# EAGLE design BBBL-CAN-GPS-RC-Interface (EAGLE 9.1.1)
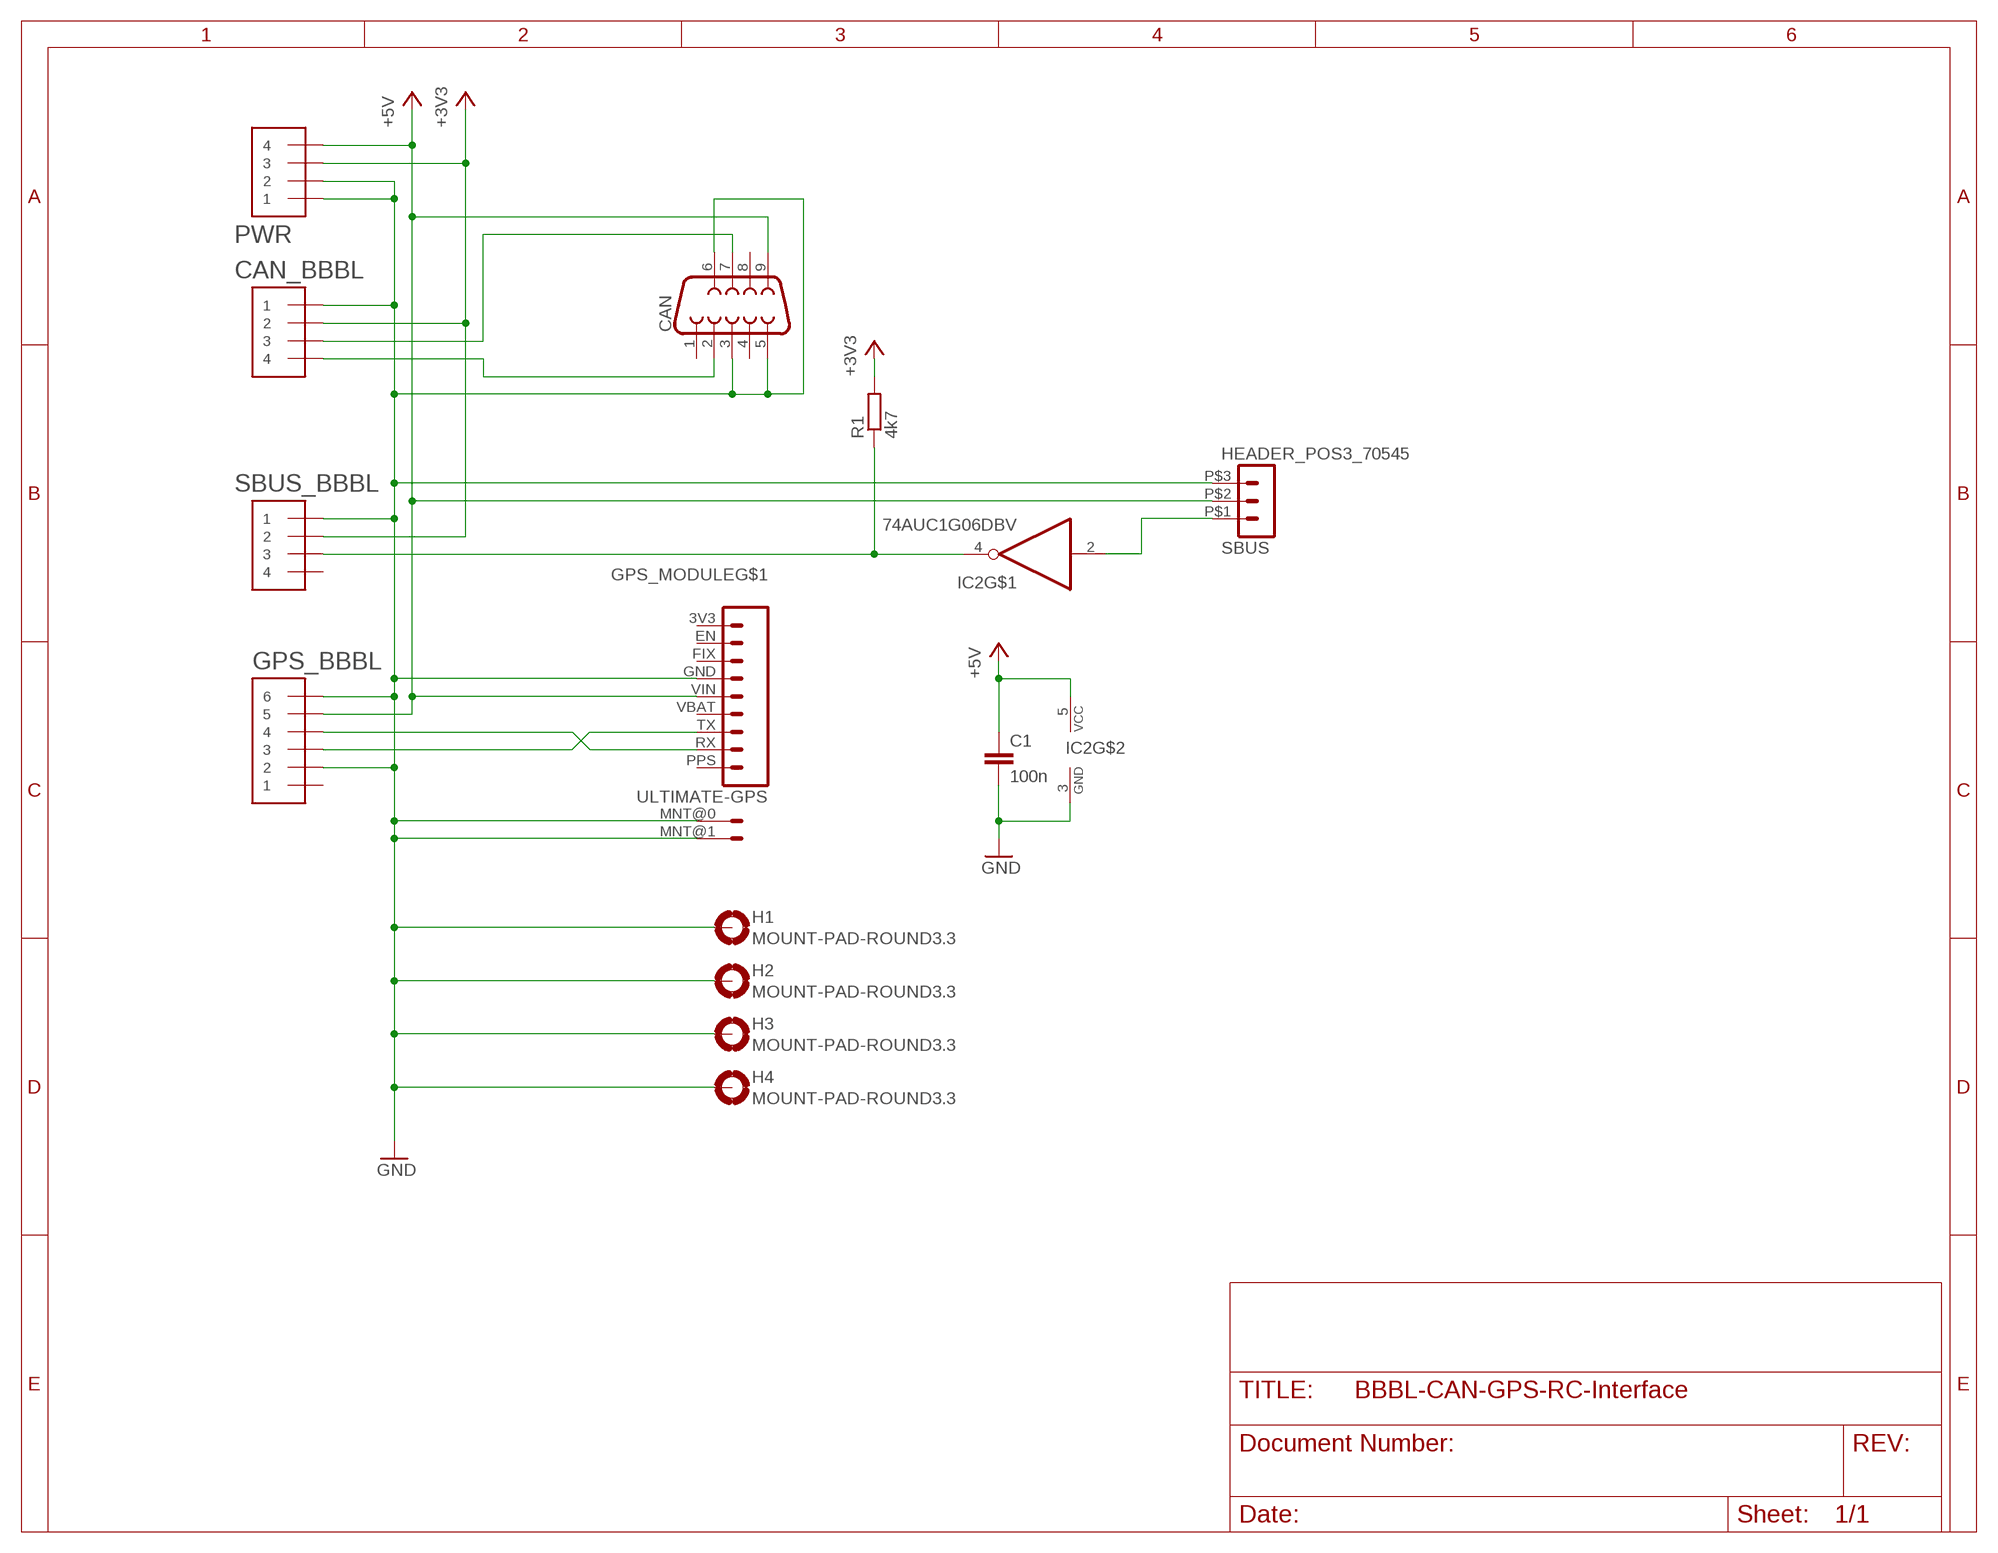
[diagram p0: schematic, sheet 1]

## Parts
C1  100n  C-EUC0603  [C0603]
CAN  DB9MALE  [DB9_MALE]
CAN_BBBL  STRAWSON_EAGLE_LIB_JST_SH_4  [STRAWSON_EAGLE_LIB_JST_SH_4_SMD]
GPS_BBBL  STRAWSON_EAGLE_LIB_JST_SH_6  [STRAWSON_EAGLE_LIB_JST_SH_6]
GPS_MODULE  ULTIMATE-GPS  [ULTIMATE-GPS]
H1  MOUNT-PAD-ROUND3.3  [3,3-PAD]
H2  MOUNT-PAD-ROUND3.3  [3,3-PAD]
H3  MOUNT-PAD-ROUND3.3  [3,3-PAD]
H4  MOUNT-PAD-ROUND3.3  [3,3-PAD]
IC2  74AUC1G06DBV  [SOT23-5]
PWR  STRAWSON_EAGLE_LIB_JST_SH_4  [STRAWSON_EAGLE_LIB_JST_SH_4_SMD]
R1  4k7  R-EU_R0603  [R0603]
SBUS  HEADER_POS3_70545  [70545-POS3]
SBUS_BBBL  STRAWSON_EAGLE_LIB_JST_SH_4  [STRAWSON_EAGLE_LIB_JST_SH_4_SMD]

## Nets
+3V3: CAN_BBBL.2 PWR.3 R1.2 SBUS_BBBL.2
+5V: C1.1 CAN.9 GPS_BBBL.5 GPS_MODULE.VIN IC2.5(VCC) PWR.4 SBUS.P$2
GND: C1.2 CAN.3 CAN.5 CAN.6 CAN_BBBL.1 GPS_BBBL.2 GPS_BBBL.6 GPS_MODULE.GND GPS_MODULE.MNT@0 GPS_MODULE.MNT@1 H1.B3,3(MOUNT) H2.B3,3(MOUNT) H3.B3,3(MOUNT) H4.B3,3(MOUNT) IC2.3(GND) PWR.1 PWR.2 SBUS.P$3 SBUS_BBBL.1
N$1: GPS_BBBL.3 GPS_MODULE.TX
N$2: GPS_BBBL.4 GPS_MODULE.RX
N$3: CAN.7 CAN_BBBL.3
N$4: CAN.2 CAN_BBBL.4
N$5: IC2.4(O) R1.1 SBUS_BBBL.3
N$6: IC2.2(I) SBUS.P$1
Unconnected: CAN.1 CAN.4 CAN.8 GPS_BBBL.1 GPS_MODULE.3V3 GPS_MODULE.EN GPS_MODULE.FIX GPS_MODULE.PPS GPS_MODULE.VBAT SBUS_BBBL.4

## Library data of the parts
C1 = resistor:C-EU: CAPACITOR, European symbol
CAN = SparkFun-Connectors:DB9: DB9 Connector Standard DB9 (D-Sub 9) serial connector. Can be used for CAN bus as well as RS485 and RS232. Footprint production proven. Here is the female version connector we sell at SparkFun: 9 Pin Female Serial Connector - PCB Mount <https://www.sparkfun.com/products/429> (PRT-00429) This connector has been used on the following SparkFun products: SparkFun RS232 Shifter - SMD <https://www.sparkfun.com/products/449> (PRT-00449) SparkFun RS232 Shifter SMD (No DB9) <https://www.sparkfun.com/products/8780> (PRT-08780); PROD_ID: CONN-09904
CAN_BBBL PWR SBUS_BBBL = BeagleBone_Blue:STRAWSON_EAGLE_LIB_JST_SH_4
GPS_BBBL = BeagleBone_Blue:STRAWSON_EAGLE_LIB_JST_SH_6
GPS_MODULE = adafruit-sensor-boards:ULTIMATE-GPS
H1-H4 = holes:MOUNT-PAD-ROUND: MOUNTING PAD, round
IC2 = 74xx-little-us:74*1G06: Single Inverter Buffer/Driver With Open-Drain Output
R1 = resistor:R-EU_: RESISTOR, European symbol
SBUS = con-molex-c-grid-sl:HEADER_POS3_?: Molex -C-Grid® / SL Series connector Wire-to-Board 2.54 mm (0.100") pitch header, 3 positions.

## Board
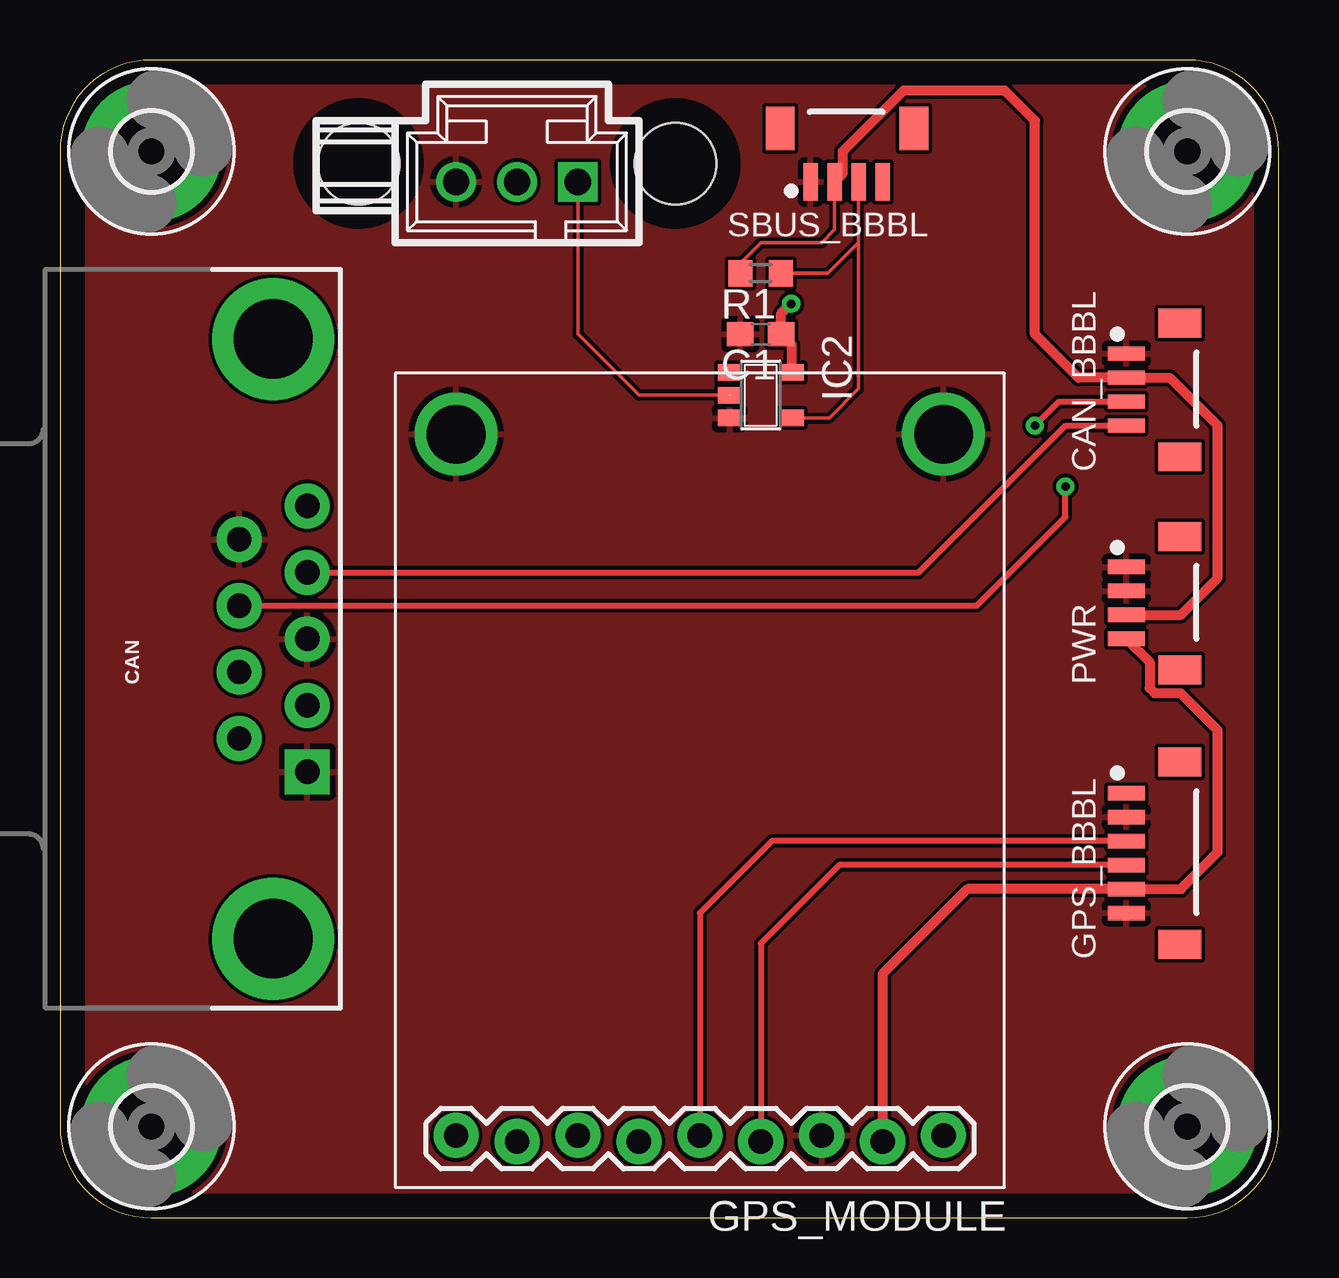
[diagram p1: board, top side]
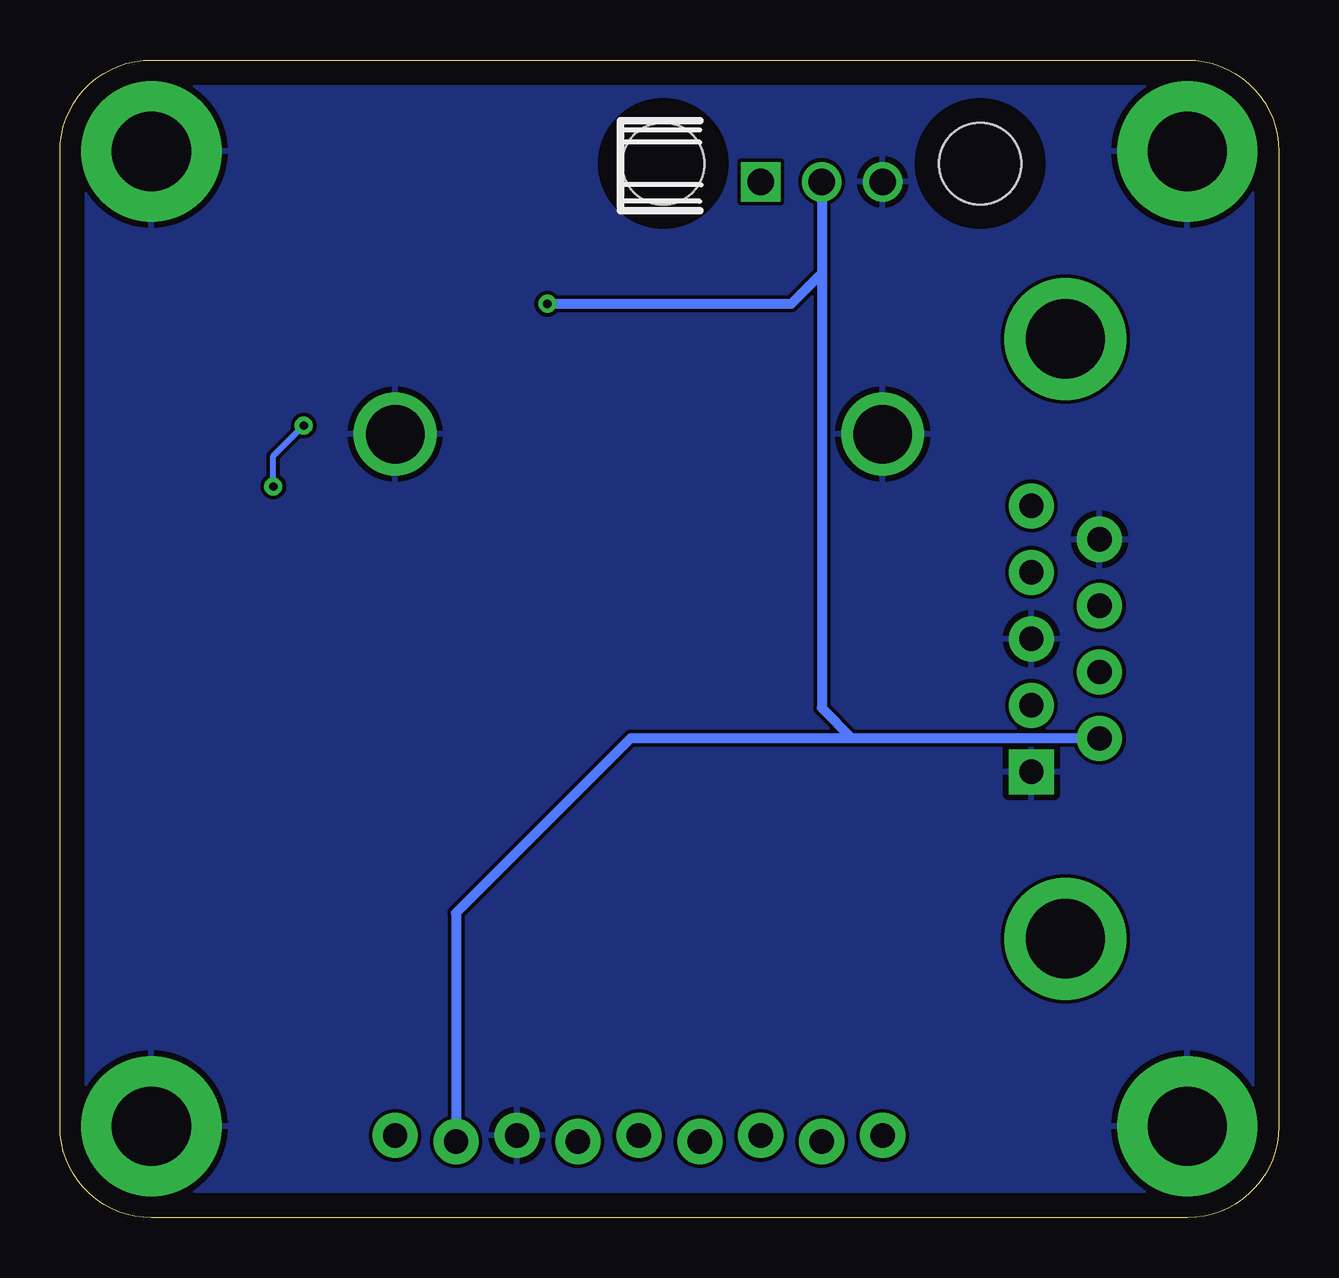
[diagram p2: board, bottom side, seen from below]

Size 50.8 x 48.26 mm. Coordinates in mm from the lower left corner, seen from the top.
Outline: 0,44.45 0,3.81 arc90 3.81,0 46.99,0 arc90 50.8,3.81 50.8,44.45 arc90 46.99,48.26 3.81,48.26 arc90 0,44.45
Copper layers (1*16): Top 0.035mm / dielectric 1.5mm / Bottom 0.035mm
Design rules "default": minimum track width 6mil, minimum drill 0.35mm, track to track 6mil, track to pad 6mil, pad to pad 6mil, via to via 6mil, smd to smd 6mil, copper to edge 40mil, drill to drill 6mil, minimum pad ring 10mil, minimum via ring 8mil, stop-mask expansion 4mil, vias tented up to drill 0mil, thermal gap 10mil

### Footprints (pad centres in the part's own frame; a part is rotated, then mirrored left to right if it is on the bottom)
C0603 = smd 1.1 x 1: 1 -0.85,0; 2 0.85,0
DB9_MALE = drill 1.016 pad 1.88: 1 5.54,-1.42; 2 2.77,-1.42; 3 0,-1.42; 4 -2.77,-1.42; 6 4.15,1.42; 7 1.38,1.42; 8 -1.38,1.42; 9 -4.15,1.42 | drill 1.016 pad 1.88 square: 5 -5.54,-1.42 | drill 3.302 pad 5.08: G1 -12.5,0; G2 12.5,0
STRAWSON_EAGLE_LIB_JST_SH_4_SMD = smd 0.6 x 1.55: 1 0.46,1.27; 2 -0.54,1.27; 3 -1.54,1.27; 4 -2.54,1.27 | smd 1.2 x 1.8: P$1 -3.84,-0.955; P$2 1.728,-0.955
STRAWSON_EAGLE_LIB_JST_SH_6 = smd 0.6 x 1.55: 1 5,0; 2 4,0; 3 3,0; 4 2,0; 5 1,0; 6 0,0 | smd 1.2 x 1.8: P$1 -1.3,-2.225; P$2 6.3,-2.225
ULTIMATE-GPS = drill 1.016 pad 1.88: 3V3 2.54,2.159; EN 5.08,1.905; FIX 10.16,1.905; GND 17.78,2.159; PPS 22.86,2.159; RX 15.24,1.905; TX 12.7,2.159; VBAT 7.62,2.159; VIN 20.32,1.905 | drill 2.438: MNT@0 2.54,31.394; MNT@1 22.86,31.394
3,3-PAD = drill 3.3 pad 5.842: B3,3 0,0
SOT23-5 = smd 0.69 x 0.99: 1 -0.95,-1.29; 2 0,-1.29; 3 0.95,-1.29; 4 0.95,1.3; 5 -0.95,1.3
R0603 = smd 1 x 1.1: 1 -0.85,0; 2 0.85,0
70545-POS3 = drill 1.1 square: P$1 2.54,0 | drill 1.1: P$2 0,0; P$3 -2.54,0 | hole 3.404: -6.604,0.762; 6.604,0.762

### Placement (x,y rotation side)
C1  29.21,36.83 180 top
CAN  8.89,24.13 90 top
CAN_BBBL  45.72,35.56 90 top
GPS_BBBL  44.45,12.7 90 top
GPS_MODULE  13.97,1.27 0 top
H1  3.81,3.81 0 top
H2  3.81,44.45 0 top
H3  46.99,44.45 0 top
H4  46.99,3.81 0 top
IC2  29.21,34.29 270 top
PWR  45.72,26.67 90 top
R1  29.21,39.37 180 top
SBUS  19.05,43.18 0 top
SBUS_BBBL  31.75,44.45 180 top

### Tracks (layer width: path | path; a pad name or v marks a point on that pad's centre or on a via)
+3V3
  Top 0.152: SBUS_BBBL.2 32.29,41.18 31.75,40.64 29.21,40.64 28.36,39.79 R1.2
  Top 0.406: PWR.3 46.72,25.13 48.26,26.67 48.26,33.02 46.26,35.02 CAN_BBBL.2 42.45,35.02 40.64,36.83 40.64,45.72 39.37,46.99 35.17,46.99 32.63,44.45 32.63,43.52 SBUS_BBBL.2
+5V  (via drill 0.35)
  Top 0.406: GPS_MODULE.VIN 34.29,10.16 37.83,13.7 GPS_BBBL.5 46.72,13.7 48.26,15.24 48.26,20.32 46.71,21.87 45.63,21.87 45.42,22.08 45.42,23.16 PWR.4 | IC2.5 30.51,36.38 C1.1 30.06,37.68 v30.48,38.1
  Bottom 0.406: CAN.9 17.78,19.98 | 17.78,19.98 27.01,19.98 34.29,12.7 GPS_MODULE.VIN | SBUS.P$2 19.05,39.37 | 19.05,39.37 19.05,21.25 17.78,19.98 | v30.48,38.1 20.32,38.1 19.05,39.37
GND
  pour Top: -1.27,-1.27 52.07,-1.27 52.07,49.53 -1.27,49.53
  pour Bottom: -2.54,-2.54 53.34,-2.54 53.34,50.8 -2.54,50.8
N$1
  Top 0.254: GPS_BBBL.3 29.67,15.7 26.67,12.7 GPS_MODULE.TX
N$2
  Top 0.254: GPS_BBBL.4 32.48,14.7 29.21,11.43 GPS_MODULE.RX
N$3  (via drill 0.35)
  Top 0.254: CAN.7 38.21,25.51 41.91,29.21 v41.91,30.48 | v40.64,33.02 41.64,34.02 CAN_BBBL.3
  Bottom 0.254: v41.91,30.48 41.91,31.75 v40.64,33.02
N$4
  Top 0.254: CAN.2 35.79,26.9 41.91,33.02 CAN_BBBL.4
N$5
  Top 0.152: 33.29,40.64 33.29,34.56 32.07,33.34 IC2.4 | 33.29,40.64 SBUS_BBBL.3 | R1.1 32.02,39.37 33.29,40.64
N$6
  Top 0.152: SBUS.P$1 21.59,36.83 24.13,34.29 IC2.2